# Altium schematic sheet CNTL.SchDoc
size A3; PageSetup: Record=PageOptions|CenterHorizontal=True|CenterVertical=True|PrintScale=0.25|XCorrection=1.00|YCorrection=1.00|PrintKind=1|BorderSize=5000000|LeftOffset=0|BottomOffset=0|Orientation=2|PaperLength=1000|PaperWidth=1000|Scale=100|PaperSource=15|PrintQuality=600|MediaType=1|DitherType=10|PaperKind=Legal|PrintScaleMode=1
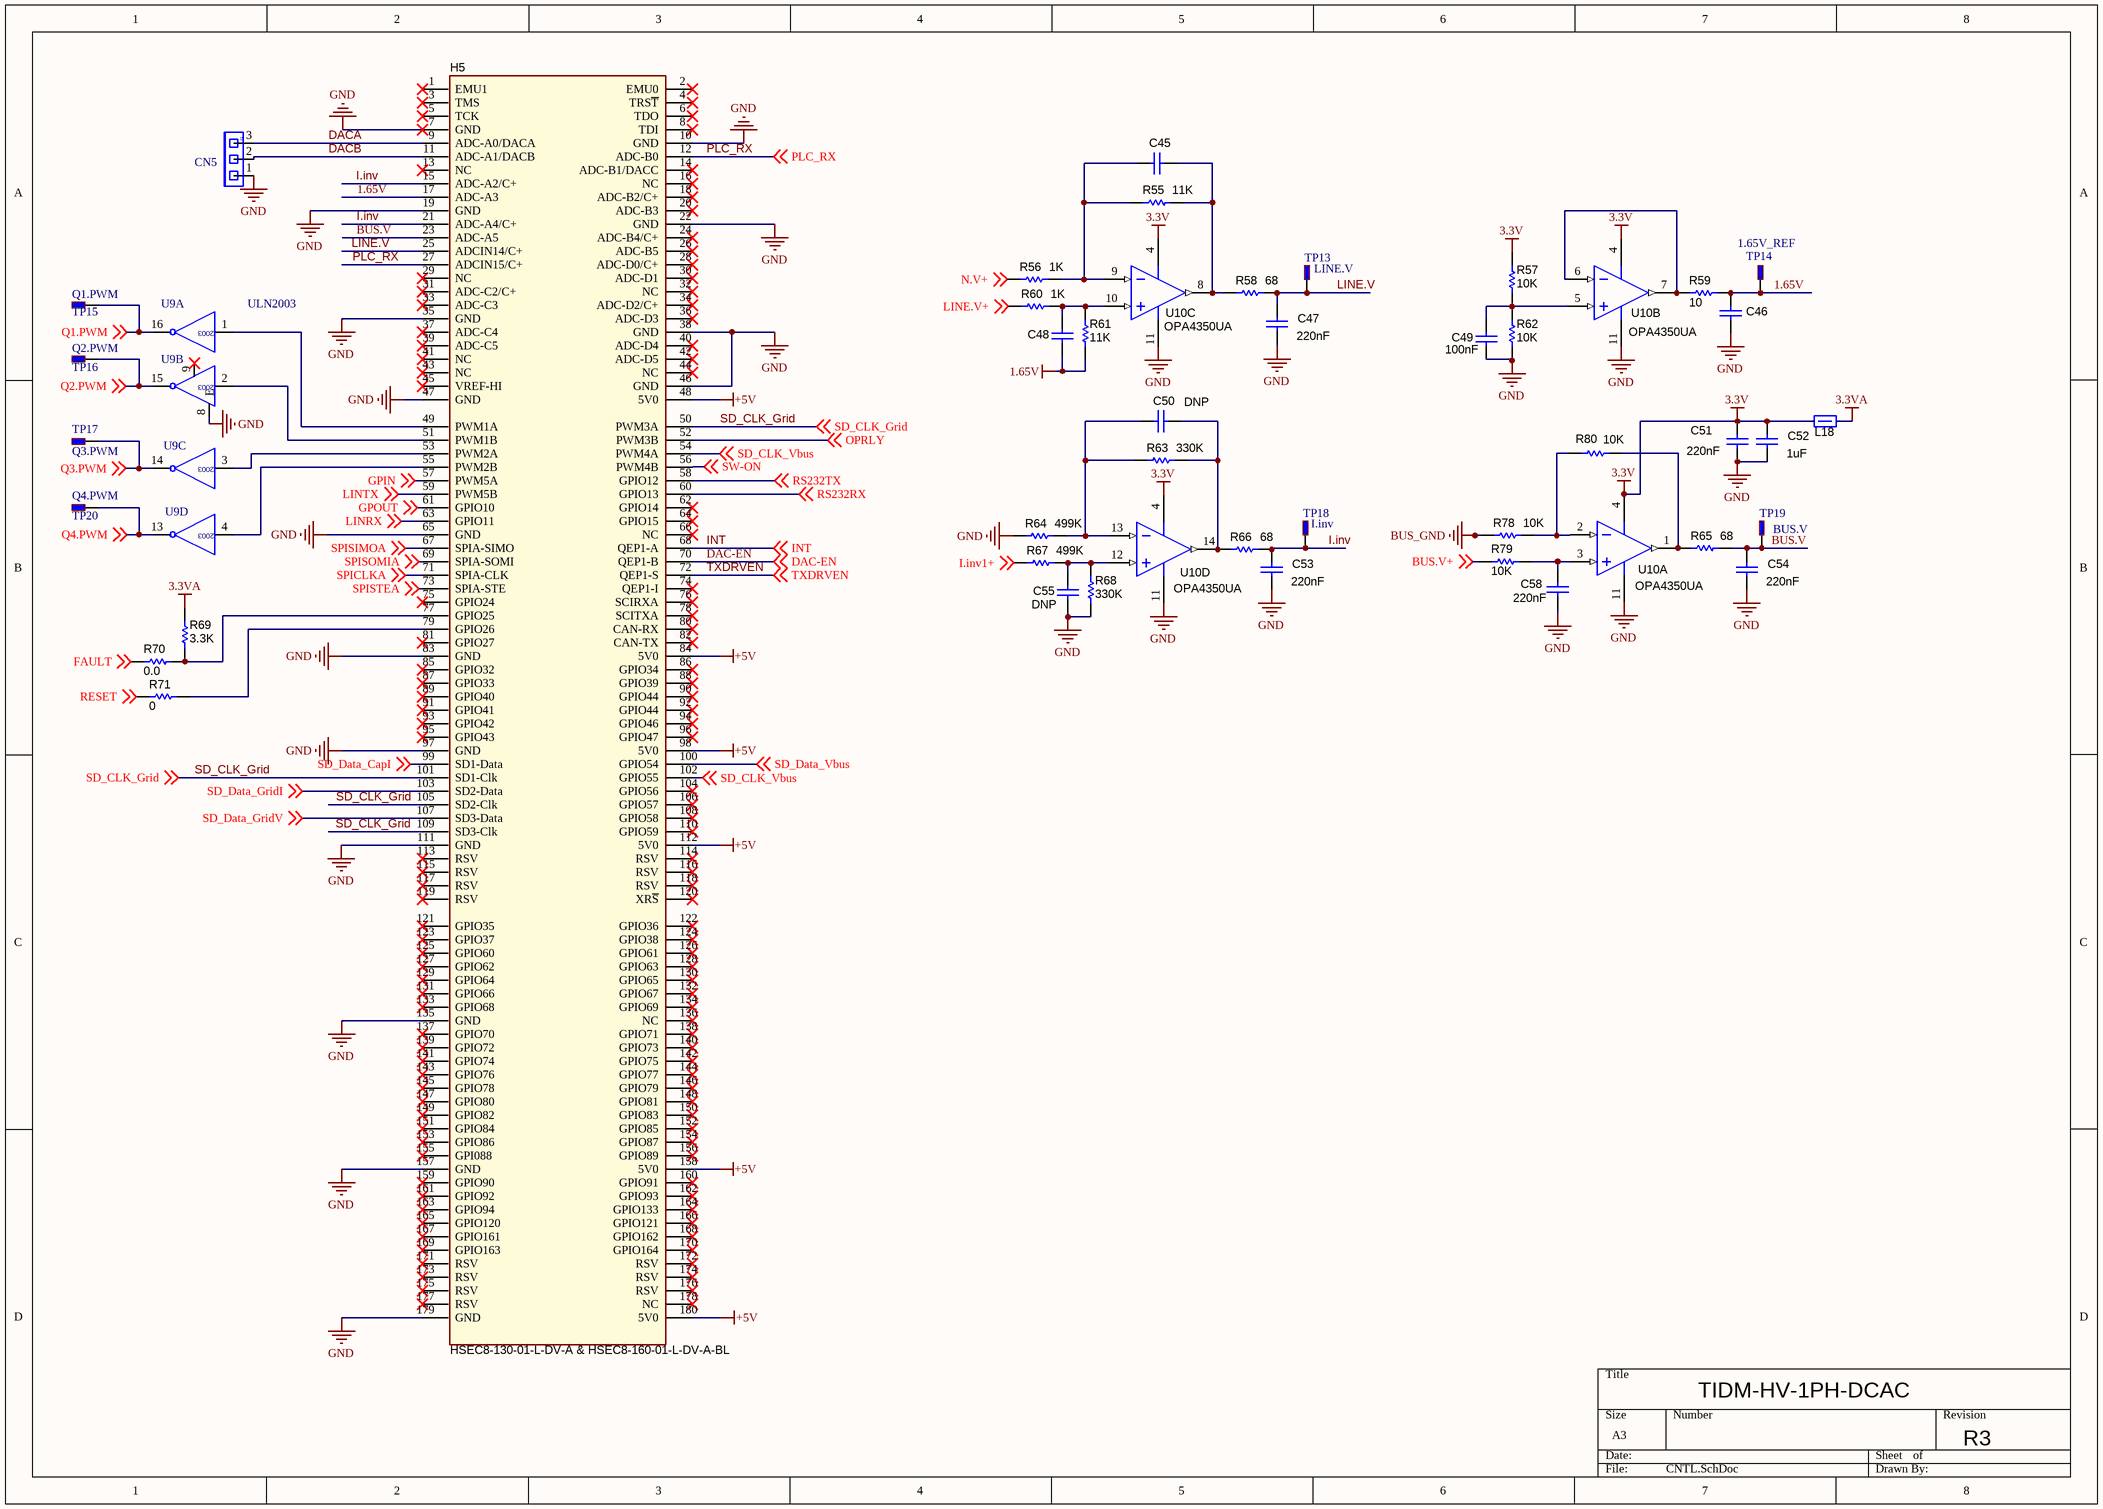
[diagram p0: CNTL.SchDoc]

## Parts
C45  Used in BOM report  [0603]  (value not drawn)
C46  Used in BOM report  [0603]  (value not drawn)
C47  value 220nF  [0603]  (hidden comment: Used in BOM report)
C48  Used in BOM report  [0603]  (value not drawn)
C49  value 100nF  [0603]  (hidden comment: Used in BOM report)
C50  value DNP  [0603]  (hidden comment: Used in BOM report)
C51  value 220nF  [0603]  (hidden comment: Used in BOM report)
C52  value 1uF  [0603]  (hidden comment: Used in BOM report)
C53  value 220nF  [0603]  (hidden comment: Used in BOM report)
C54  value 220nF  [0603]  (hidden comment: Used in BOM report)
C55  value DNP  [0603]  (hidden comment: Used in BOM report)
C58  value 220nF  [0603]  (hidden comment: Used in BOM report)
CN5  SCI_PORT  [HDR1X3]  (value not drawn)
H5  HSEC8-130-01-L-DV-A & HSEC8-160-01-L-DV-A-BL  [HEADER_HSEC8_180_DV]
L18  LQM21FN220N00L  [0805]  (value not drawn)
R55  value 11K  [0603]  (hidden comment: Used in BOM report)
R56  value 1K  [0603]  (hidden comment: Used in BOM report)
R57  value 10K  [0603]  (hidden comment: Used in BOM report)
R58  value 68  [0603]  (hidden comment: Used in BOM report)
R59  value 10  [0603]  (hidden comment: Used in BOM report)
R60  value 1K  [0603]  (hidden comment: Used in BOM report)
R61  value 11K  [0603]  (hidden comment: Used in BOM report)
R62  value 10K  [0603]  (hidden comment: Used in BOM report)
R63  value 330K  [0603]  (hidden comment: Used in BOM report)
R64  value 499K  [0603]  (hidden comment: Used in BOM report)
R65  value 68  [0603]  (hidden comment: Used in BOM report)
R66  value 68  [0603]  (hidden comment: Used in BOM report)
R67  value 499K  [0603]  (hidden comment: Used in BOM report)
R68  value 330K  [0603]  (hidden comment: Used in BOM report)
R69  value 3.3K  [0805]  (hidden comment: RC0805JR-071R1L)
R70  value 0.0  [0805]  (hidden comment: RC0805JR-071R1L)
R71  value 0  [0805]  (hidden comment: RC0805JR-071R1L)
R78  value 10K  [0603]  (hidden comment: Used in BOM report)
R79  value 10K  [0603]  (hidden comment: Used in BOM report)
R80  value 10K  [0603]  (hidden comment: Used in BOM report)
TP13  LINE.V  [PIN1]
TP14  1.65V_REF  [PIN1]
TP15  Q1.PWM  [PIN1]
TP16  Q2.PWM  [PIN1]
TP17  Q3.PWM  [PIN1]
TP18  I.inv  [PIN1]
TP19  BUS.V  [PIN1]
TP20  Q4.PWM  [PIN1]
U9  ULN2003  [2003SM]  (value not drawn)  (parts A,B,C,D of 7)
U10  OPA4350UA  [D0014A_N]  (parts A,B,C,D of 4)

## Nets
1.65V: C46.1 C48.2 H5.17(ADC-A3) R59.1 R61.1 TP14.1
3.3V: C51.1 C52.1 L18.2 R57.2 U10.4(V+)
3.3VA: L18.1 R69.2
+5V: H5.48(5V0) H5.84(5V0) H5.98(5V0) H5.112(5V0) H5.158(5V0) H5.180(5V0)
BUS_GND: R78.1
GND: C46.2 C47.2 C49.2 C51.2 C52.2 C53.2 C54.2 C55.2 C58.2 CN5.1 H5.7(GND) H5.10(GND) H5.19(GND) H5.22(GND) H5.35(GND) H5.38(GND) H5.46(GND) H5.47(GND) H5.65(GND) H5.83(GND) H5.97(GND) H5.111(GND) H5.135(GND) H5.157(GND) H5.179(GND) R62.1 R64.1 R68.1 U9.8(E) U10.11(V-)
BUS.V: C54.1 H5.23(ADC-A5) R65.2 TP19.1
BUS.V+: R79.2 ; off-sheet BUS.V+
DAC-EN: H5.70(QEP1-B) ; off-sheet DAC-EN
DACA: CN5.3 H5.9(ADC-A0/DACA)
DACB: CN5.2 H5.11(ADC-A1/DACB)
FAULT: R70.1 ; off-sheet FAULT
GPIN: H5.57(PWM5A) ; off-sheet GPIN
GPOUT: H5.61(GPIO10) ; off-sheet GPOUT
I.inv: C53.1 H5.15(ADC-A2/C+) H5.21(ADC-A4/C+) R66.2 TP18.1
I.inv1+: R67.1 ; off-sheet I.inv1+
INT: H5.68(QEP1-A) ; off-sheet INT
LINE.V: C47.1 H5.25(ADCIN14/C+) R58.2 TP13.1
LINE.V+: R60.1 ; off-sheet LINE.V+
LINRX: H5.63(GPIO11) ; off-sheet LINRX
LINTX: H5.59(PWM5B) ; off-sheet LINTX
N.V+: R56.1 ; off-sheet N.V+
OPRLY: H5.52(PWM3B) ; off-sheet OPRLY
PLC_RX: H5.12(ADC-B0) H5.27(ADCIN15/C+) ; off-sheet PLC_RX
Q1.PWM: TP15.1 U9.16 ; off-sheet Q1.PWM
Q2.PWM: TP16.1 U9.15 ; off-sheet Q2.PWM
Q3.PWM: TP17.1 U9.14 ; off-sheet Q3.PWM
Q4.PWM: TP20.1 U9.13 ; off-sheet Q4.PWM
RESET: R71.1 ; off-sheet RESET
RS232RX: H5.60(GPIO13) ; off-sheet RS232RX
RS232TX: H5.58(GPIO12) ; off-sheet RS232TX
SD_CLK_Grid: H5.50(PWM3A) H5.101(SD1-Clk) H5.105(SD2-Clk) H5.109(SD3-Clk) ; off-sheet SD_CLK_Grid
SD_CLK_Vbus: H5.54(PWM4A) H5.102(GPIO55) ; off-sheet SD_CLK_Vbus
SD_Data_CapI: H5.99(SD1-Data) ; off-sheet SD_Data_CapI
SD_Data_GridI: H5.103(SD2-Data) ; off-sheet SD_Data_GridI
SD_Data_GridV: H5.107(SD3-Data) ; off-sheet SD_Data_GridV
SD_Data_Vbus: H5.100(GPIO54) ; off-sheet SD_Data_Vbus
SPICLKA: H5.71(SPIA-CLK) ; off-sheet SPICLKA
SPISIMOA: H5.67(SPIA-SIMO) ; off-sheet SPISIMOA
SPISOMIA: H5.69(SPIA-SOMI) ; off-sheet SPISOMIA
SPISTEA: H5.73(SPIA-STE) ; off-sheet SPISTEA
SW-ON: H5.56(PWM4B) ; off-sheet SW-ON
TXDRVEN: H5.72(QEP1-S) ; off-sheet TXDRVEN
NetC45_1: C45.1 R55.1 R56.2 U10.9(IN_C-)
NetC45_2: C45.2 R55.2 R58.1 U10.8(OUT_C)
NetC48_1: C48.1 R60.2 R61.2 U10.10(IN_C+)
NetC49_1: C49.1 R57.1 R62.2 U10.5(IN_B+)
NetC50_1: C50.1 R63.1 R64.2 U10.13(IN_D-)
NetC50_2: C50.2 R63.2 R66.1 U10.14(OUT_D)
NetC55_1: C55.1 R67.2 R68.2 U10.12(IN_D+)
NetC58_1: C58.1 R79.1 U10.3(IN_A+)
NetH5_49: H5.49(PWM1A) U9.1
NetH5_51: H5.51(PWM1B) U9.2
NetH5_53: H5.53(PWM2A) U9.3
NetH5_55: H5.55(PWM2B) U9.4
NetH5_77: H5.77(GPIO25) R69.1 R70.2
NetH5_79: H5.79(GPIO26) R71.2
NetR59_2: R59.2 U10.6(IN_B-) U10.7(OUT_B)
NetR65_1: R65.1 R80.2 U10.1(OUT_A)
NetR78_2: R78.2 R80.1 U10.2(IN_A-)

Not connected (* = marked no-connect by the designer): H5 1(EMU1)* 2(EMU0)* 3(TMS)* 4(TRS~{T})* 5(TCK)* 6(TDO)* 8(TDI)* 13(NC)* 14(ADC-B1/DACC)* 16(NC)* 18(ADC-B2/C+)* 20(ADC-B3)* 24(ADC-B4/C+)* 26(ADC-B5)* 28(ADC-D0/C+)* 29(NC)* 30(ADC-D1)* 31(ADC-C2/C+)* 32(NC)* 33(ADC-C3)* 34(ADC-D2/C+)* 36(ADC-D3)* 37(ADC-C4)* 39(ADC-C5)* 40(ADC-D4)* 41(NC)* 42(ADC-D5)* 43(NC)* 44(NC)* 45(VREF-HI)* 62(GPIO14)* 64(GPIO15)* 66(NC)* 74(QEP1-I)* 75(GPIO24)* 76(SCIRXA)* 78(SCITXA)* 80(CAN-RX)* 81(GPIO27)* 82(CAN-TX)* 85(GPIO32)* 86(GPIO34)* 87(GPIO33)* 88(GPIO39)* 89(GPIO40)* 90(GPIO44)* 91(GPIO41)* 92(GPIO44)* 93(GPIO42)* 94(GPIO46)* 95(GPIO43)* 96(GPIO47)* 104(GPIO56)* 106(GPIO57)* 108(GPIO58)* 110(GPIO59)* 113(RSV)* 114(RSV)* 115(RSV)* 116(RSV)* 117(RSV)* 118(RSV)* 119(RSV)* 120(XR~{S})* 121(GPIO35)* 122(GPIO36)* 123(GPIO37)* 124(GPIO38)* 125(GPIO60)* 126(GPIO61)* 127(GPIO62)* 128(GPIO63)* 129(GPIO64)* 130(GPIO65)* 131(GPIO66)* 132(GPIO67)* 133(GPIO68)* 134(GPIO69)* 136(NC)* 137(GPIO70)* 138(GPIO71)* 139(GPIO72)* 140(GPIO73)* 141(GPIO74)* 142(GPIO75)* 143(GPIO76)* 144(GPIO77)* 145(GPIO78)* 146(GPIO79)* 147(GPIO80)* 148(GPIO81)* 149(GPIO82)* 150(GPIO83)* 151(GPIO84)* 152(GPIO85)* 153(GPIO86)* 154(GPIO87)* 155(GPI088)* 156(GPIO89)* 159(GPIO90)* 160(GPIO91)* 161(GPIO92)* 162(GPIO93)* 163(GPIO94)* 164(GPIO133)* 165(GPIO120)* 166(GPIO121)* 167(GPIO161)* 168(GPIO162)* 169(GPIO163)* 170(GPIO164)* 171(RSV)* 172(RSV)* 173(RSV)* 174(RSV)* 175(RSV)* 176(RSV)* 177(RSV)* 178(NC)*; U9 9(COM)

## Notes on the sheet
- TIDM-HV-1PH-DCAC
- R3
- (in symbol 2003SM, part A) 2003
- (in symbol 2003SM, part B) 2003
- (in symbol 2003SM, part C) 2003
- (in symbol 2003SM, part D) 2003
- (in symbol DB01P03) F

## Library data of the parts
C45 C47-C55 C58 = Capacitor: CAP, CERM, xxxF, xxV, [TempCo], xx%, [PackageReference]; Polarized: N; U/M: EA; CompType: Capacitor; SymbolVersion: 2008-07-09; PackageReference: Used in PnP output; Manufacturer: Used in BOM report; PartNumber: Used in BOM report; RoHS: Used in BOM report.  Use Y or N.; MountType: SMT or TH (used in PnP report); ComponentLink1Description: Datasheet Link; ComponentLink1URL: Paste URL for datasheet here; Publisher: Texas Instruments; LatestRevisionDate: 2014-06-06; LatestRevisionNote: Added Alternate PartNumber and Alternate Manufacturer parameters to appropriate components.; Alternate Manufacturer: -; Alternate PartNumber: -
  C45 C48: Value: *
C46 = Capacitor: CAP, CERM, xxxF, xxV, [TempCo], xx%, [PackageReference]; Polarized: N; Value: 10nF; U/M: EA; CompType: Capacitor; SymbolVersion: 2008-07-09; PackageReference: Used in PnP output; Manufacturer: Used in BOM report; PartNumber: Used in BOM report; RoHS: Used in BOM report.  Use Y or N.; MountType: SMT or TH (used in PnP report); ComponentLink1Description: Datasheet Link; ComponentLink1URL: Paste URL for datasheet here; Publisher: Texas Instruments; LatestRevisionDate: 2014-06-06; LatestRevisionNote: Added Alternate PartNumber and Alternate Manufacturer parameters to appropriate components.; Alternate Manufacturer: -; Alternate PartNumber: -
CN5 = DB01P03: Value: SCI_PORT
H5 = HEADER_HSEC_180_F2837x_HVDCACSolar: Manufacturer: Samtech; SymbolVersion: use current date i.e. 2008-05-20; SymbolCreator: Use a-id; CompType: Used in some BOM reports.  Useful for finding later.; U/M: EA, IN, or GM; MountType: SMT, TH, or N/A; RoHS: Used in BOM report.  Use Y or N.; PartNumber: HSEC8-130-01-L-DV-A & HSEC8-160-01-L-DV-A-BL; PackageReference: eg:  0603, used in PnP report; ComponentLink1Description: Datasheet Link; Alternate PartNumber: -; Alternate Manufacturer: -
L18 = MMZ2012R300A: Ferrite Bead, 30 ohm @ 100MHz, 1.5A, 0805; Manufacturer: Murata; Value: 22µH; DCR_ohm: 0.350; CompType: Ferrite Bead; SymbolVersion: 2009-06-02; PartNumber: LQM21FN220N00L; MountType: SMT; PackageReference: 0805; Published: 2014-04-30; Publisher: Texas Instruments; LatestRevisionDate: 2014-04-30; ComponentLink1Description: Datasheet link; ComponentLink1URL: http://www.digikey.com/product-detail/en/LQM21FN220N00L/490-4030-1-ND/1016290; RoHS: Y; Supplier 1: Digi-Key; Supplier Part Number 1: 490-4030-1-ND; Supplier 2: Mouser; Supplier 3: Farnell
R55 R56 R58-R61 R65 R66 R78-R80 = Resistor: RES, 1K ohm, x%, xW, [PackageReference]; U/M: EA; CompType: Resistor; SymbolVersion: 2009-05-29; PackageReference: Used in PnP output; Manufacturer: Used in BOM report; PartNumber: Used in BOM report; RoHS: Used in BOM report.  Use Y or N.; MountType: SMT or TH (used in PnP report); ComponentLink1Description: Datasheet Link; ComponentLink1URL: Paste URL for datasheet here; Publisher: Texas Instruments; LatestRevisionDate: 2014-06-06; LatestRevisionNote: Added Alternate PartNumber and Alternate Manufacturer parameters to appropriate components.; Alternate Manufacturer: -; Alternate PartNumber: -
R57 R62 = Resistor: RES, 10K ohm, x%, xW, [PackageReference]; U/M: EA; CompType: Resistor; SymbolVersion: 2009-05-29; PackageReference: Used in PnP output; Manufacturer: Used in BOM report; PartNumber: Used in BOM report; RoHS: Used in BOM report.  Use Y or N.; MountType: SMT or TH (used in PnP report); ComponentLink1Description: Datasheet Link; ComponentLink1URL: Paste URL for datasheet here; Publisher: Texas Instruments; LatestRevisionDate: 2014-06-06; LatestRevisionNote: Added Alternate PartNumber and Alternate Manufacturer parameters to appropriate components.; Alternate Manufacturer: -; Alternate PartNumber: -
R63 R68 = Resistor: RES, 330K ohm, x%, xW, [PackageReference]; U/M: EA; CompType: Resistor; SymbolVersion: 2009-05-29; PackageReference: Used in PnP output; Manufacturer: Used in BOM report; PartNumber: Used in BOM report; RoHS: Used in BOM report.  Use Y or N.; MountType: SMT or TH (used in PnP report); ComponentLink1Description: Datasheet Link; ComponentLink1URL: Paste URL for datasheet here; Publisher: Texas Instruments; LatestRevisionDate: 2014-06-06; LatestRevisionNote: Added Alternate PartNumber and Alternate Manufacturer parameters to appropriate components.; Alternate Manufacturer: -; Alternate PartNumber: -
R64 R67 = Resistor: RES, 499K ohm, x%, xW, [PackageReference]; U/M: EA; CompType: Resistor; SymbolVersion: 2009-05-29; PackageReference: Used in PnP output; Manufacturer: Used in BOM report; PartNumber: Used in BOM report; RoHS: Used in BOM report.  Use Y or N.; MountType: SMT or TH (used in PnP report); ComponentLink1Description: Datasheet Link; ComponentLink1URL: Paste URL for datasheet here; Publisher: Texas Instruments; LatestRevisionDate: 2014-06-06; LatestRevisionNote: Added Alternate PartNumber and Alternate Manufacturer parameters to appropriate components.; Alternate Manufacturer: -; Alternate PartNumber: -
R69 = RC0805JR-071R1L: RES, 3.3Kohm, 5%, 0.125W, 0805; Manufacturer: Yageo America; CompType: Resistor; Res_ohm: 3.3; Value_Code: 1R10; Tolerance_%: 5; Power_W: 0.125; VDC_V: 150; TempCo: 200 ppm/C; EIA_Code: E24; U/M: EA; SymbolVersion: 2009-05-29; PartNumber: RC0805JR-071R1L; PackageReference: 0805; RoHS: Y; Value1: 5%; Value2: 0.125W; MountType: SMT; Technology: Thick Film; Published: 2008-06-26; Publisher: Texas Instruments; LatestRevisionDate: 2014-04-18; ComponentLink1Description: Datasheet link; ComponentLink1URL: http://www.yageo.com/pdf/Pu-RC0805_51_PbFree_L_2.pdf; Supplier 1: Digi-Key; Supplier Part Number 1: 311-1.1ARCT-ND; Supplier 2: Mouser; Supplier Part Number 2: 603-RC0805JR-071R1L; Supplier 3: Farnell; Supplier Part Number 3: 1799483
R70 = RC0805JR-071R1L: RES, 0 ohm, 5%, 0.125W, 0805; Manufacturer: Yageo America; CompType: Resistor; Res_ohm: 0; Value_Code: 1R10; Tolerance_%: 5; Power_W: 0.125; VDC_V: 150; TempCo: 200 ppm/C; EIA_Code: E24; U/M: EA; SymbolVersion: 2009-05-29; PartNumber: RC0805JR-071R1L; PackageReference: 0805; RoHS: Y; Value1: 5%; Value2: 0.125W; MountType: SMT; Technology: Thick Film; Published: 2008-06-26; Publisher: Texas Instruments; LatestRevisionDate: 2014-04-18; ComponentLink1Description: Datasheet link; ComponentLink1URL: http://www.yageo.com/pdf/Pu-RC0805_51_PbFree_L_2.pdf; Supplier 1: Digi-Key; Supplier Part Number 1: 311-1.1ARCT-ND; Supplier 2: Mouser; Supplier Part Number 2: 603-RC0805JR-071R1L; Supplier 3: Farnell; Supplier Part Number 3: 1799483
R71 = RC0805JR-071R1L: RES, 0.0 ohm, 5%, 0.125W, 0805; Manufacturer: Yageo America; CompType: Resistor; Value_Code: 1R10; Tolerance_%: 5; Power_W: 0.125; VDC_V: 150; TempCo: 200 ppm/C; EIA_Code: E24; U/M: EA; SymbolVersion: 2009-05-29; PartNumber: RC0805JR-071R1L; PackageReference: 0805; RoHS: Y; Res_ohm: 0; Value1: 5%; Value2: 0.125W; MountType: SMT; Technology: Thick Film; Published: 2008-06-26; Publisher: Texas Instruments; LatestRevisionDate: 2014-04-18; ComponentLink1Description: Datasheet link; ComponentLink1URL: http://www.yageo.com/pdf/Pu-RC0805_51_PbFree_L_2.pdf; Supplier 1: Digi-Key; Supplier Part Number 1: 311-1.1ARCT-ND; Supplier 2: Mouser; Supplier Part Number 2: 603-RC0805JR-071R1L; Supplier 3: Farnell; Supplier Part Number 3: 1799483
TP13-TP20 = PIN1: ZR
U9 = 2003SM: Value: {Value}
U10 = OPA4350UA: High-Speed, Single-Supply, Rail-to-Rail Operational Amplifier MicroAmplifier(TM) Series, 2.7 to 5.5 V, -55 to 150 degC, 14-pin SOIC (D0014A), Green (RoHS & no Sb/Br); Manufacturer: Texas Instruments; Alternate Manufacturer: None; Alternate PartNumber: Equivalent; CMRR(Min)(dB): 66; IIB(Max)(pA): 10; Iq per channel(Max)(mA): 7.5; Number of Channels: 4; Slew Rate(Typ)(V/us): 22; Sub Family: Low Input Bias Current Amp (<=10pA), Low Offset Voltage Amplifier (<=500uV), Low Supply Voltage Amplifier (<=2.7V), Precision Amplifier; Total Supply Voltage(Max)(+5V is 5, +/-5V is 10): 5.5; Total Supply Voltage(Min)(+5V is 5, +/-5V is 10): 2.7; Vio (25C)(Max)(mV): 0.5; Vn at 1kHz(Typ)(nV/rtHz): 18; DatasheetVersion: SBOS099C; PackageVersion: 4040047-5/M, 06/2011; PackageReference: D0014A; PackageDescription: 14-Pin Plastic Small Outline, Body 8.65 x 3.9 mm, Pitch 1.27 mm; Supplier 1: Digi-Key; Supplier Part Number 1: OPA4350UA-ND; Supplier 2: Farnell; Supplier Part Number 2: 1097445; Supplier 3: Newark; Supplier Part Number 3: 74K3912; Supplier 4: Mouser; Supplier Part Number 4: 595-OPA4350UA; Eco-Plan: Green (RoHS & no Sb/Br); Offset Drift(Typ)(uV/C): 4; MountType: SMT; Code_JEDEC: MS-012; PartNumber: OPA4350UA; ComponentLink1Description: Manufacturer URL; ComponentLink1URL: http://www.ti.com/; ComponentLink2Description: Datasheet; ComponentLink2URL: http://www.ti.com/general/docs/lit/getliterature.tsp?genericPartNumber=OPA4350&fileType=pdf; ComponentLink3Description: Package Specification; ComponentLink3URL: http://www.ti.com/lit/ml/mpds177g/mpds177g.pdf